# EAGLE design SSB Transceiver_Supply PCB (EAGLE 9.4.2)
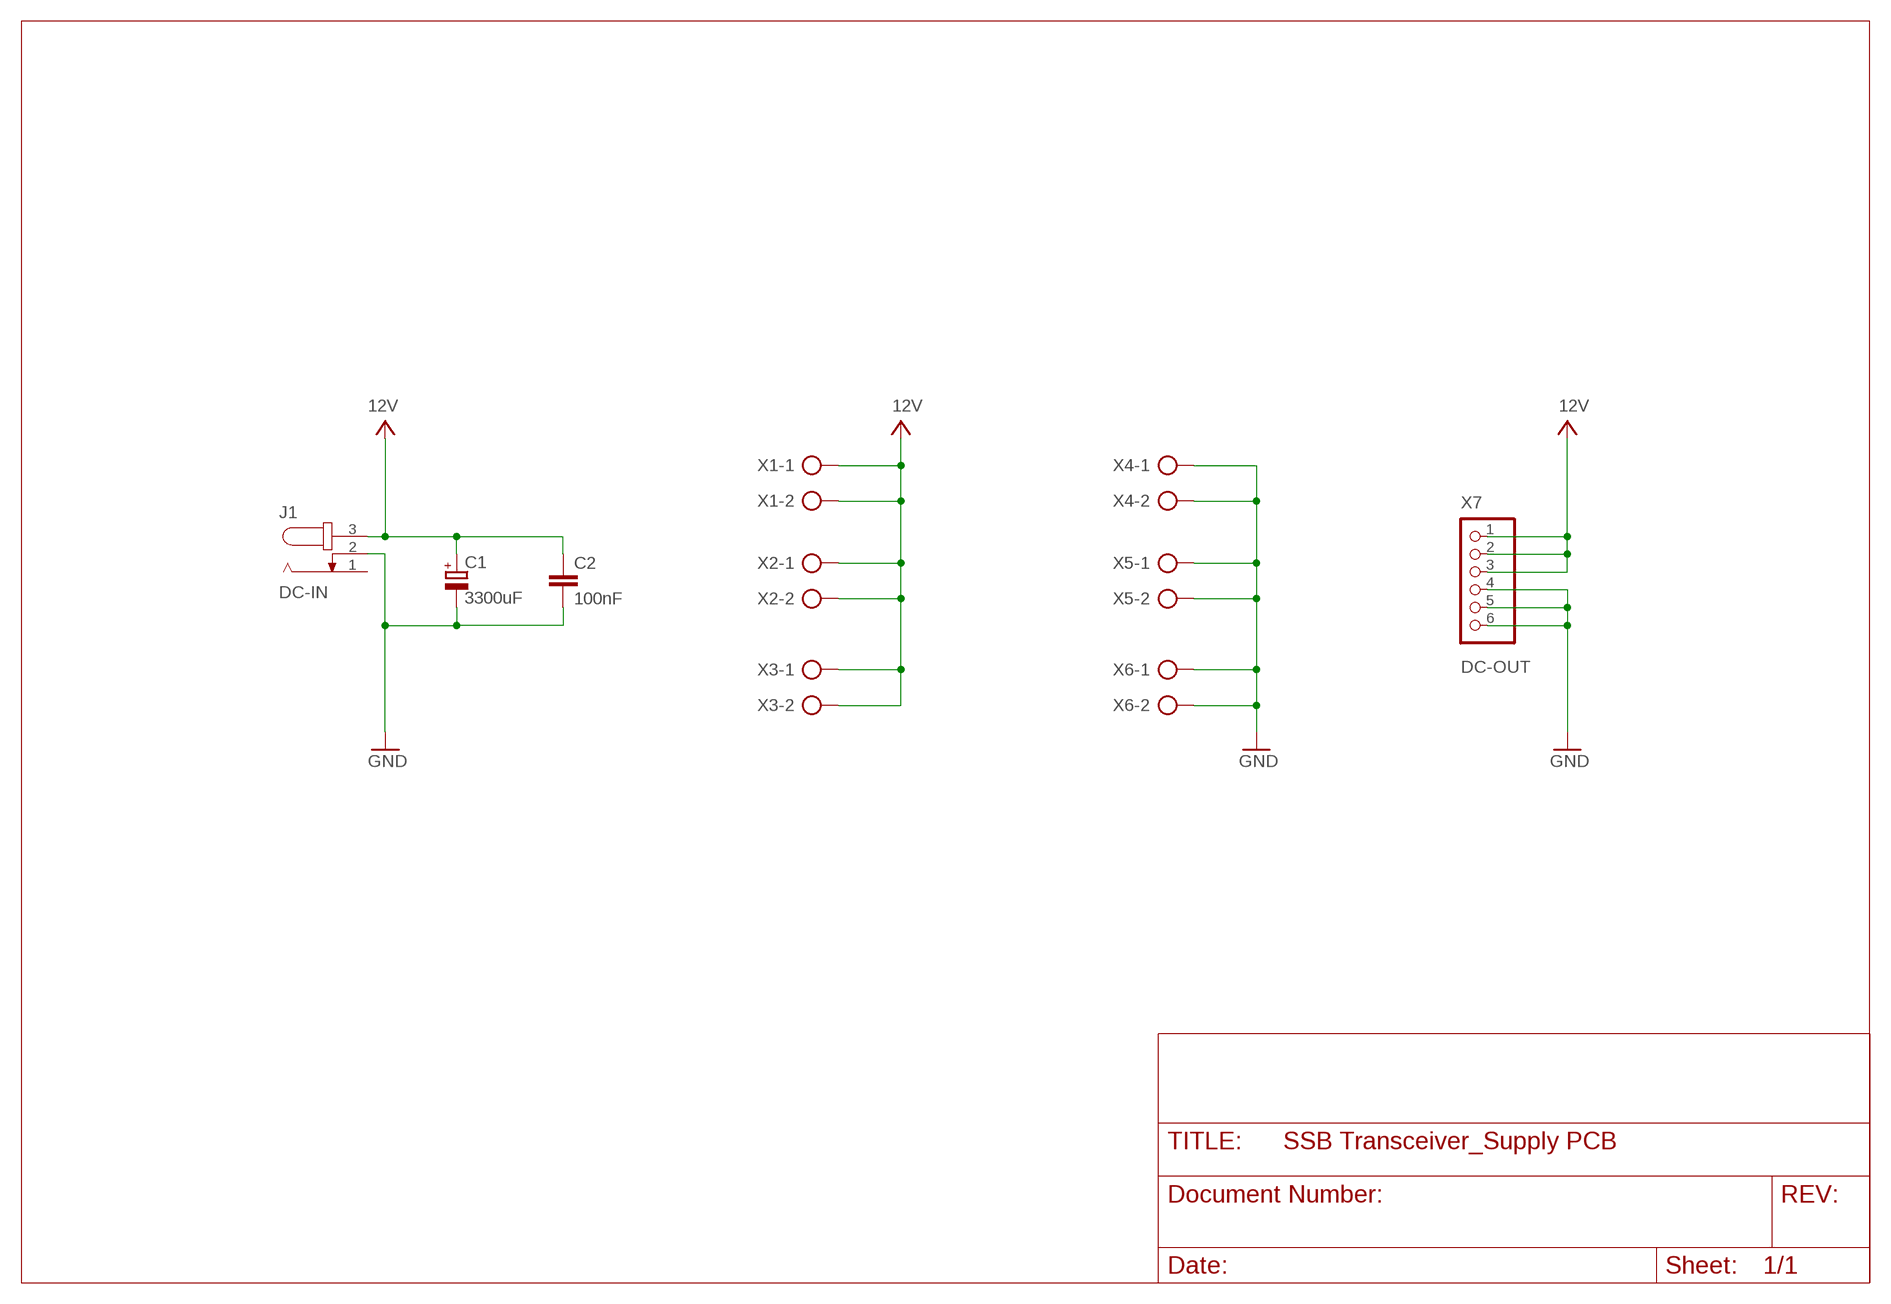
[diagram p0: schematic, sheet 1]

## Parts
C1  3300uF  CPOL-EUE7.5-16  [E7,5-16]
C2  100nF  C-EUC0805K  [C0805K]
J1  DC-IN  JACK-PLUG1  [SPC4078]
X1  12V  AK300/2  [AK300/2]
X2  AK300/2  [AK300/2]
X3  AK300/2  [AK300/2]
X4  AK300/2  [AK300/2]
X5  AK300/2  [AK300/2]
X6  AK300/2  [AK300/2]
X7  DC-OUT  PINHD-1X6  [1X06]

## Nets
GND: C1.- C2.2 J1.2 X4.1 X4.2 X5.1 X5.2 X6.1 X6.2 X7.4 X7.5 X7.6
VCC: C1.+ C2.1 J1.3 X1.1 X1.2 X2.1 X2.2 X3.1 X3.2 X7.1 X7.2 X7.3 ; supply symbol labelled 12V
Unconnected: J1.1

## Library data of the parts
C1 = rcl:CPOL-EU: POLARIZED CAPACITOR, European symbol; SPICEPREFIX: C
C2 = rcl:C-EU: CAPACITOR, European symbol; SPICEPREFIX: C
J1 = con-jack:JACK-PLUG: DC POWER JACK Power Jack, DC, Right Angle, Through Hole, Rated 5A at 16VDC, PC Terminals Distributor: Farnell (www.Farnell.de) Drawing: 84N1161.pdf / 84N1162.pdf Manufacturer: SPC Technology (www.spctechnology.com) Type: SPC4077 / SPC 4078; OC_FARNELL: unknown; OC_NEWARK: unknown
X1-X6 = con-ptr500:AK300/2: CONNECTOR; OC_FARNELL: unknown; OC_NEWARK: unknown
X7 = pinhead:PINHD-1X6: PIN HEADER

## Board
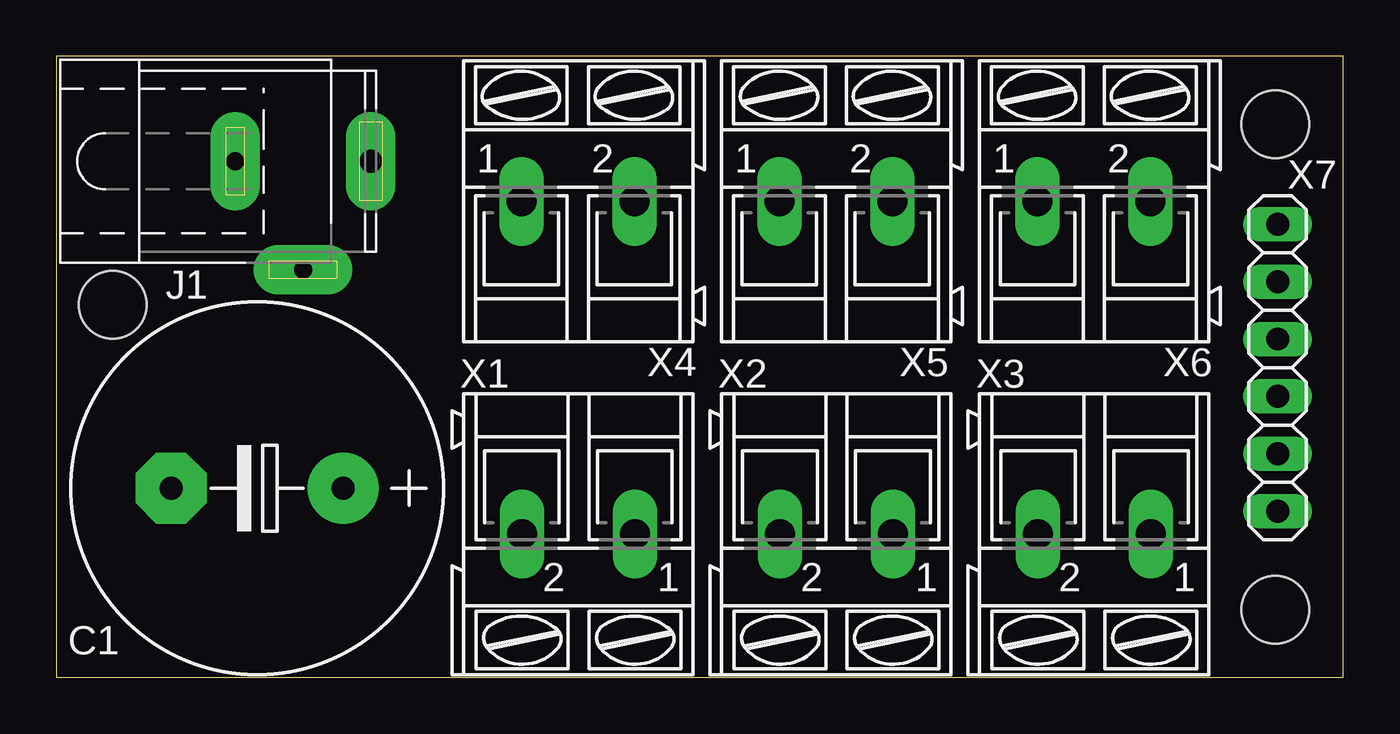
[diagram p1: board, top side]
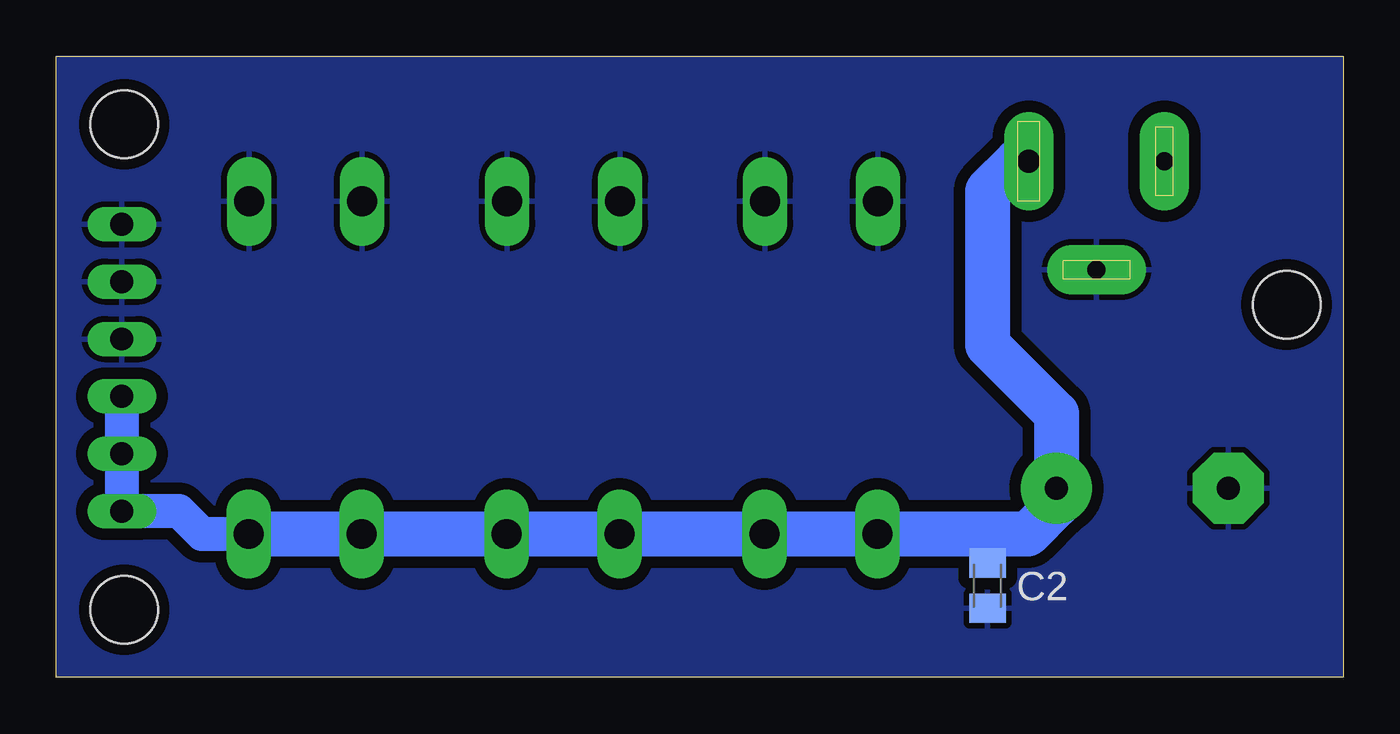
[diagram p2: board, bottom side, seen from below]

Size 57 x 27.5 mm. Coordinates in mm from the lower left corner, seen from the top.
Outline: 0,0 57,0 57,27.5 0,27.5 0,0
Copper layers (1*16): Top 0.035mm / dielectric 1.5mm / Bottom 0.035mm
Design rules "default *": minimum track width 6mil, minimum drill 0.35mm, track to track 20mil, track to pad 20mil, pad to pad 20mil, via to via 20mil, smd to smd 6mil, copper to edge 0mil, drill to drill 6mil, minimum pad ring 10mil, minimum via ring 8mil, stop-mask expansion 4mil, vias tented up to drill 0mil, thermal gap 10mil
Holes 3 mm at 2.5,16.51 54,24.5 54,3

### Footprints (pad centres in the part's own frame; a part is rotated, then mirrored left to right if it is on the bottom)
E7,5-16 = drill 1.016 pad 3.15: + -3.81,0 | drill 1.016 pad 3.15 octagon: - 3.81,0
C0805K = smd 1.3 x 1.6: 1 -1,0; 2 1,0
SPC4078 = drill 0.8 pad 2.184 long: 1 -3,0; 2 0,-4.8 | drill 1 pad 2.184 long: 3 3,0
AK300/2 = drill 1.321 long: 1 -2.515,0; 2 2.489,0
1X06 = drill 1.016 long: 1 -6.35,0; 2 -3.81,0; 3 -1.27,0; 4 1.27,0; 5 3.81,0; 6 6.35,0

### Placement (x,y rotation side)
C1  8.89,8.38 180 top
C2  15.75,4.06 270 bottom
J1  10.92,22.86 0 top
X1  23.11,6.35 180 top
X2  34.54,6.35 180 top
X3  45.97,6.35 180 top
X4  23.11,21.08 0 top
X5  34.54,21.08 0 top
X6  45.97,21.08 0 top
X7  54.1,13.72 90 top

### Tracks (layer width: path | path; a pad name or v marks a point on that pad's centre or on a via)
GND
  pour Bottom (isolate 0.5): 0,0 0,27.5 57,27.5 57,0
VCC
  Bottom 1: C2.1 15.75,6.35
  Bottom 1.5: X7.3 X7.2 X7.1 51.56,7.37 50.55,6.35 X3.1
  Bottom 2: X3.1 X3.2 X2.1 X2.2 X1.1 X1.2 15.75,6.35 13.97,6.35 12.7,7.62 C1.+ 12.7,11.68 15.75,14.73 15.75,21.54 14.43,22.86 J1.3